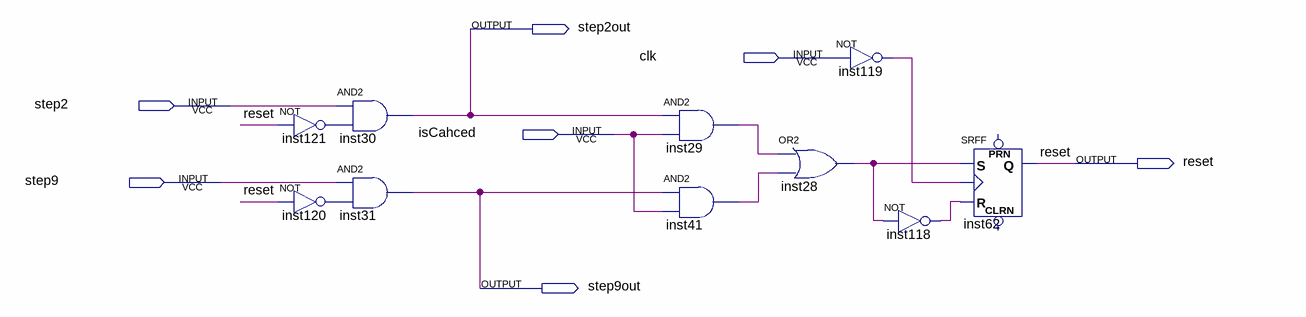
[diagram p0: schematic sheet]
// Quartus schematic ShifterRegister.bdf as structural Verilog: 10 symbols, 7 pins
module ShifterRegister (
  input  clk,
  input  step2,
  input  isCahced,
  input  step9,
  output step2out,
  output reset,
  output step9out
);

  wire inst28_out, inst29_out, inst41_out, inst118_out, inst119_out, inst120_out, inst121_out;

  not inst121 (inst121_out, reset);
  not inst120 (inst120_out, reset);
  and inst30 (step2, step2, inst121_out);
  and inst31 (step9, step9, inst120_out);
  and inst29 (inst29_out, step2, isCahced);
  and inst41 (inst41_out, step9, isCahced);
  or inst28 (inst28_out, inst29_out, inst41_out);
  not inst119 (inst119_out, clk);
  not inst118 (inst118_out, inst28_out);
  SRFF inst62 (.S(inst28_out), .R(inst118_out), .CLK(inst119_out), .Q(reset));  // open: PRN, CLRN

  assign step2out = step2;
  assign step9out = step9;
endmodule
